# EAGLE design divtiesus_v10_tiesus_del_to (EAGLE 9.6.2)
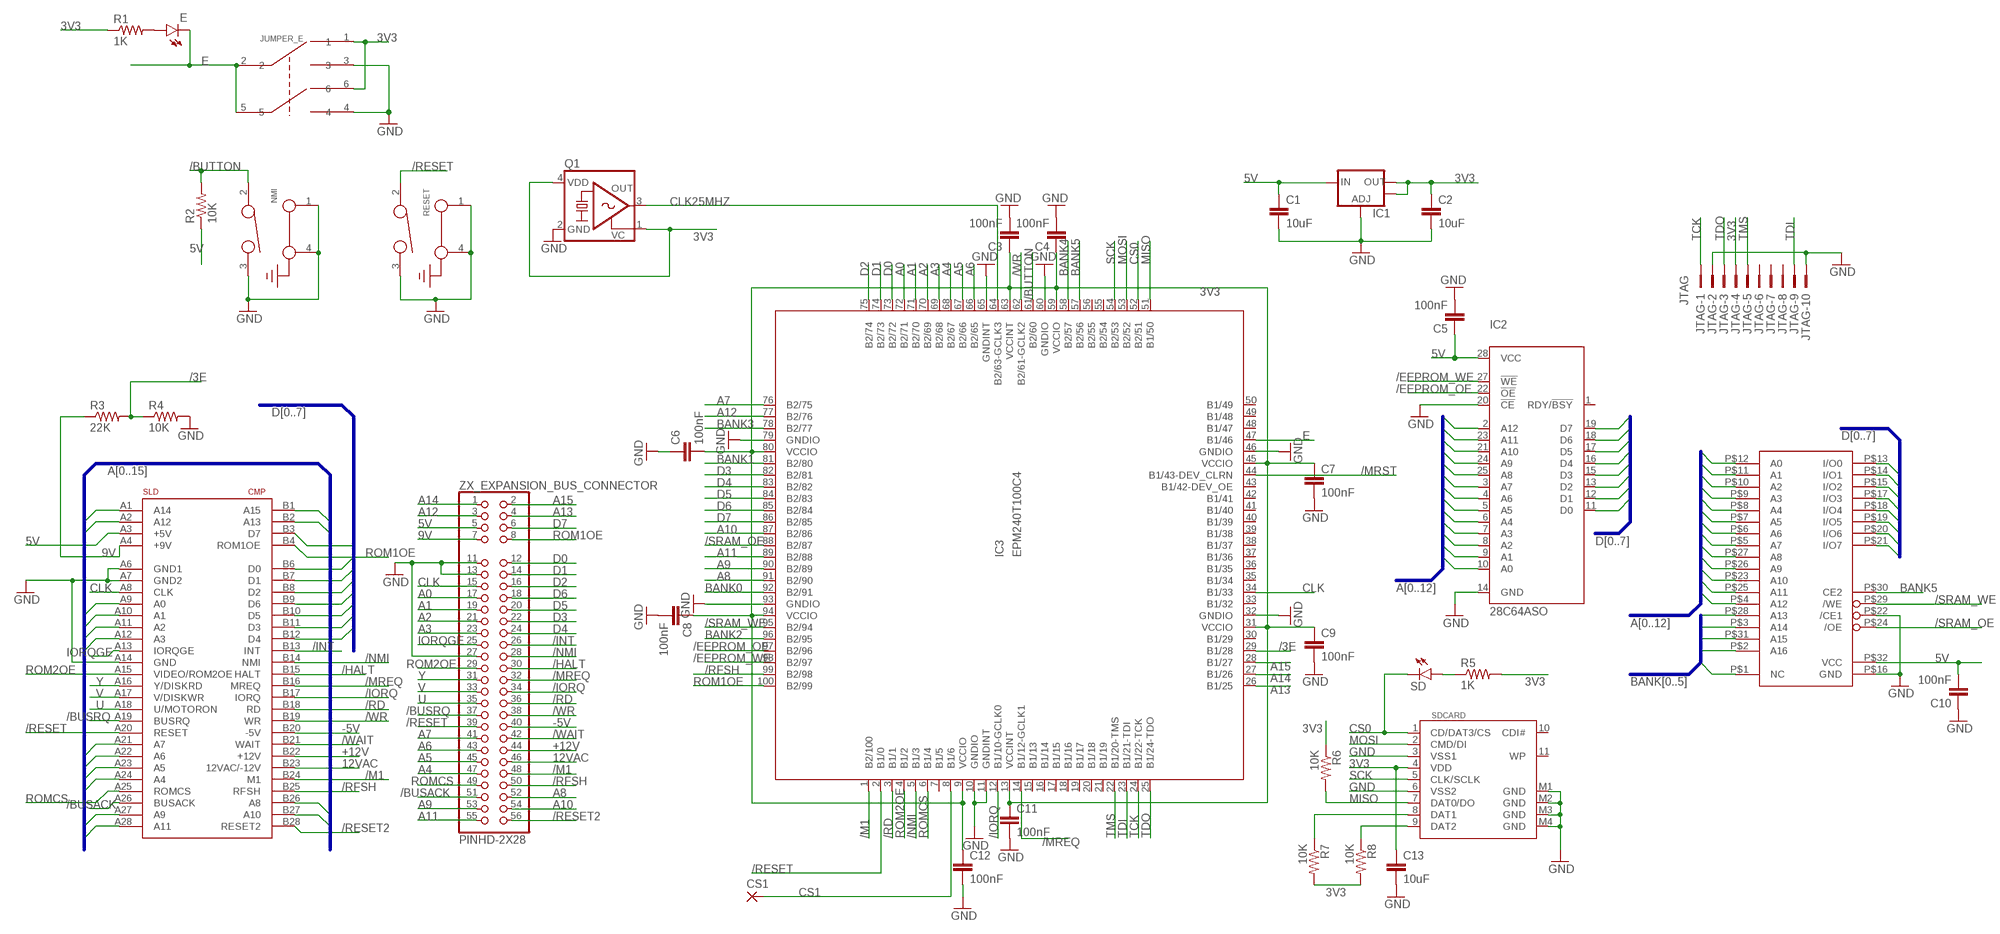
[diagram p0: schematic, sheet 1]

## Parts
C1  10uF  C-EUC0805  [C0805]
C2  10uF  C-EUC0805  [C0805]
C3  100nF  C-EUC0603K  [C0603K]
C4  100nF  C-EUC0603K  [C0603K]
C5  100nF  C-EUC0603K  [C0603K]
C6  100nF  C-EUC0603K  [C0603K]
C7  100nF  C-EUC0603K  [C0603K]
C8  100nF  C-EUC0603K  [C0603K]
C9  100nF  C-EUC0603K  [C0603K]
C10  100nF  C-EUC0603K  [C0603K]
C11  100nF  C-EUC0603K  [C0603K]
C12  100nF  C-EUC0603K  [C0603K]
C13  10uF  C-EUC0805  [C0805]
CS1  SMD2  [SMD1,27-2,54]
E  LEDCHIPLED_0805  [CHIPLED_0805]
IC1  V_REG_LM1117SOT223  [SOT223]
IC2  28C64ASO  [SO28W]
IC3  EPM240T100C4  [TQFP100]
IC4  IS65C1024ALSO32  [SO32-545MIL]
JTAG  JTAG  2510-  [PAK100/2500-10]
JUMPER_E  SWITCH_SMD_6PIN  [SMD-6PIN]
NMI  431256083716  [431256083716]
Q1  KXO-VCTCXO-SINE-84  [3.2X2.5_KXO-84-VCTCXO]
R1  1K  R-US_R0603  [R0603]
R2  10K  R-US_R0603  [R0603]
R3  22K  R-US_R0603  [R0603]
R4  10K  R-US_R0603  [R0603]
R5  1K  R-US_R0603  [R0603]
R6  10K  R-US_R0603  [R0603]
R7  10K  R-US_R0603  [R0603]
R8  10K  R-US_R0603  [R0603]
RESET  431256083716  [431256083716]
SD  LEDCHIPLED_0805  [CHIPLED_0805]
SDCARD  SDCARD  [SDCMF-10915W010]
U$1  CONECTOR_BUS_TRASERO  [CONECTOR_SIMPLE_CARA]
ZX_EXPANSION_BUS_CONNECTOR  PINHD-2X28  [2X28]

## Nets
3V3 [power]: C2.1 C3.1 C4.1 C6.2 C7.1 C8.1 C9.1 C11.1 C12.1 C13.1 IC1.2(OUT) IC1.4(OUT) IC3.9(VCCIO) IC3.13(VCCINT) IC3.31(VCCIO) IC3.45(VCCIO) IC3.59(VCCIO) IC3.63(VCCINT) IC3.80(VCCIO) IC3.94(VCCIO) JTAG.4 JUMPER_E.1 JUMPER_E.6 Q1.1(VC) Q1.4(VDD) R1.1 R5.2 R6.1 R7.2 R8.2 SDCARD.4(VDD)
5V [power]: C1.1 C5.1 C10.2 IC1.3(IN) IC2.28(VCC) IC4.P$32(VCC) R2.1 U$1.A3(+5V) ZX_EXPANSION_BUS_CONNECTOR.5
9V: R3.1 U$1.A4(+9V) ZX_EXPANSION_BUS_CONNECTOR.7
12VAC: U$1.B23(12VAC/-12V) ZX_EXPANSION_BUS_CONNECTOR.46
+12V: U$1.B22(+12V) ZX_EXPANSION_BUS_CONNECTOR.44
-5V: U$1.B20(-5V) ZX_EXPANSION_BUS_CONNECTOR.40
/3E: IC3.29(B1/28) R3.2 R4.1
/BUSACK: U$1.A26(BUSACK) ZX_EXPANSION_BUS_CONNECTOR.51
/BUSRQ: U$1.A19(BUSRQ) ZX_EXPANSION_BUS_CONNECTOR.37
/BUTTON: IC3.61(B2/60) NMI.2 R2.2
/EEPROM_OE: IC2.22(!OE) IC3.97(B2/96)
/EEPROM_WE: IC2.27(!WE) IC3.98(B2/97)
/HALT: U$1.B15(HALT) ZX_EXPANSION_BUS_CONNECTOR.30
/INT: U$1.B13(INT) ZX_EXPANSION_BUS_CONNECTOR.26
/IORQ: IC3.12(B1/10-GCLK0) U$1.B17(IORQ) ZX_EXPANSION_BUS_CONNECTOR.34
/M1: IC3.1(B2/100) U$1.B24(M1) ZX_EXPANSION_BUS_CONNECTOR.48
/MREQ: IC3.14(B1/12-GCLK1) U$1.B16(MREQ) ZX_EXPANSION_BUS_CONNECTOR.32
/MRST: IC3.44(B1/43-DEV_CLRN)
/NMI: IC3.5(B1/3) U$1.B14(NMI) ZX_EXPANSION_BUS_CONNECTOR.28
/RD: IC3.3(B1/1) U$1.B18(RD) ZX_EXPANSION_BUS_CONNECTOR.36
/RESET: IC3.2(B1/0) RESET.2 U$1.A20(RESET) ZX_EXPANSION_BUS_CONNECTOR.39
/RESET2: U$1.B28(RESET2) ZX_EXPANSION_BUS_CONNECTOR.56
/RFSH: IC3.99(B2/98) U$1.B25(RFSH) ZX_EXPANSION_BUS_CONNECTOR.50
/SRAM_OE: IC3.88(B2/87) IC4.P$24(/OE)
/SRAM_WE: IC3.95(B2/94) IC4.P$29(/WE)
/WAIT: U$1.B21(WAIT) ZX_EXPANSION_BUS_CONNECTOR.42
/WR: IC3.62(B2/61-GCLK2) U$1.B19(WR) ZX_EXPANSION_BUS_CONNECTOR.38
A0: IC2.10(A0) IC3.72(B2/71) IC4.P$12(A0) U$1.A9(A0) ZX_EXPANSION_BUS_CONNECTOR.17
A1: IC2.9(A1) IC3.71(B2/70) IC4.P$11(A1) U$1.A10(A1) ZX_EXPANSION_BUS_CONNECTOR.19
A2: IC2.8(A2) IC3.70(B2/69) IC4.P$10(A2) U$1.A11(A2) ZX_EXPANSION_BUS_CONNECTOR.21
A3: IC2.7(A3) IC3.69(B2/68) IC4.P$9(A3) U$1.A12(A3) ZX_EXPANSION_BUS_CONNECTOR.23
A4: IC2.6(A4) IC3.68(B2/67) IC4.P$8(A4) U$1.A24(A4) ZX_EXPANSION_BUS_CONNECTOR.47
A5: IC2.5(A5) IC3.67(B2/66) IC4.P$7(A5) U$1.A23(A5) ZX_EXPANSION_BUS_CONNECTOR.45
A6: IC2.4(A6) IC3.66(B2/65) IC4.P$6(A6) U$1.A22(A6) ZX_EXPANSION_BUS_CONNECTOR.43
A7: IC2.3(A7) IC3.76(B2/75) IC4.P$5(A7) U$1.A21(A7) ZX_EXPANSION_BUS_CONNECTOR.41
A8: IC2.25(A8) IC3.91(B2/90) IC4.P$27(A8) U$1.B26(A8) ZX_EXPANSION_BUS_CONNECTOR.52
A9: IC2.24(A9) IC3.90(B2/89) IC4.P$26(A9) U$1.A27(A9) ZX_EXPANSION_BUS_CONNECTOR.53
A10: IC2.21(A10) IC3.87(B2/86) IC4.P$23(A10) U$1.B27(A10) ZX_EXPANSION_BUS_CONNECTOR.54
A11: IC2.23(A11) IC3.89(B2/88) IC4.P$25(A11) U$1.A28(A11) ZX_EXPANSION_BUS_CONNECTOR.55
A12: IC2.2(A12) IC3.77(B2/76) IC4.P$4(A12) U$1.A2(A12) ZX_EXPANSION_BUS_CONNECTOR.3
A13: IC3.26(B1/25) U$1.B2(A13) ZX_EXPANSION_BUS_CONNECTOR.4
A14: IC3.27(B1/26) U$1.A1(A14) ZX_EXPANSION_BUS_CONNECTOR.1
A15: IC3.28(B1/27) U$1.B1(A15) ZX_EXPANSION_BUS_CONNECTOR.2
BANK0: IC3.92(B2/91) IC4.P$28(A13)
BANK1: IC3.81(B2/80) IC4.P$3(A14)
BANK2: IC3.96(B2/95) IC4.P$31(A15)
BANK3: IC3.78(B2/77) IC4.P$2(A16)
BANK4: IC3.58(B2/57) IC4.P$1(NC)
BANK5: IC3.57(B2/56) IC4.P$30(CE2)
CLK: IC3.34(B1/33) U$1.A8(CLK) ZX_EXPANSION_BUS_CONNECTOR.15
CLK25MHZ: IC3.64(B2/63-GCLK3) Q1.3(OUT)
CS0: IC3.52(B2/51) SD.C SDCARD.1(CD/DAT3/CS)
CS1: CS1.1(P) IC3.8(B1/6)
D0: IC2.11(D0) IC3.73(B2/72) IC4.P$13(I/O0) U$1.B6(D0) ZX_EXPANSION_BUS_CONNECTOR.12
D1: IC2.12(D1) IC3.74(B2/73) IC4.P$14(I/O1) U$1.B7(D1) ZX_EXPANSION_BUS_CONNECTOR.14
D2: IC2.13(D2) IC3.75(B2/74) IC4.P$15(I/O2) U$1.B8(D2) ZX_EXPANSION_BUS_CONNECTOR.16
D3: IC2.15(D3) IC3.82(B2/81) IC4.P$17(I/O3) U$1.B11(D3) ZX_EXPANSION_BUS_CONNECTOR.22
D4: IC2.16(D4) IC3.83(B2/82) IC4.P$18(I/O4) U$1.B12(D4) ZX_EXPANSION_BUS_CONNECTOR.24
D5: IC2.17(D5) IC3.84(B2/83) IC4.P$19(I/O5) U$1.B10(D5) ZX_EXPANSION_BUS_CONNECTOR.20
D6: IC2.18(D6) IC3.85(B2/84) IC4.P$20(I/O6) U$1.B9(D6) ZX_EXPANSION_BUS_CONNECTOR.18
D7: IC2.19(D7) IC3.86(B2/85) IC4.P$21(I/O7) U$1.B3(D7) ZX_EXPANSION_BUS_CONNECTOR.6
E: E.C IC3.47(B1/46) JUMPER_E.2 JUMPER_E.5
GND [power]: C1.2 C2.2 C3.2 C4.2 C5.2 C6.1 C7.2 C8.2 C9.2 C10.1 C11.2 C12.2 C13.2 IC1.1(ADJ) IC2.14(GND) IC2.20(!CE) IC3.10(GNDIO) IC3.11(GNDINT) IC3.32(GNDIO) IC3.46(GNDIO) IC3.60(GNDIO) IC3.65(GNDINT) IC3.79(GNDIO) IC3.93(GNDIO) IC4.P$16(GND) IC4.P$22(/CE1) JTAG.2 JTAG.10 JUMPER_E.3 JUMPER_E.4 NMI.1(GND1) NMI.3 NMI.4(GND) Q1.2(GND) R4.2 RESET.1(GND1) RESET.3 RESET.4(GND) SDCARD.3(VSS1) SDCARD.6(VSS2) SDCARD.M1(GND) SDCARD.M2(GND) SDCARD.M3(GND) SDCARD.M4(GND) U$1.A6(GND1) U$1.A7(GND2) U$1.A14(GND) ZX_EXPANSION_BUS_CONNECTOR.11 ZX_EXPANSION_BUS_CONNECTOR.13 ZX_EXPANSION_BUS_CONNECTOR.27
IORQGE: U$1.A13(IORQGE) ZX_EXPANSION_BUS_CONNECTOR.25
MISO: IC3.51(B1/50) R6.2 SDCARD.7(DAT0/DO)
MOSI: IC3.53(B2/52) SDCARD.2(CMD/DI)
N$1: R5.1 SD.A
N$2: E.A R1.2
N$18: R7.1 SDCARD.8(DAT1)
N$20: R8.1 SDCARD.9(DAT2)
ROM1OE: IC3.100(B2/99) U$1.B4(ROM1OE) ZX_EXPANSION_BUS_CONNECTOR.8
ROM2OE: IC3.4(B1/2) U$1.A15(VIDEO/ROM2OE) ZX_EXPANSION_BUS_CONNECTOR.29
ROMCS: IC3.6(B1/4) U$1.A25(ROMCS) ZX_EXPANSION_BUS_CONNECTOR.49
SCK: IC3.54(B2/53) SDCARD.5(CLK/SCLK)
TCK: IC3.24(B1/22-TCK) JTAG.1
TDI: IC3.23(B1/21-TDI) JTAG.9
TDO: IC3.25(B1/24-TDO) JTAG.3
TMS: IC3.22(B1/20-TMS) JTAG.5
U: U$1.A18(U/MOTORON) ZX_EXPANSION_BUS_CONNECTOR.35
V: U$1.A17(V/DISKWR) ZX_EXPANSION_BUS_CONNECTOR.33
Y: U$1.A16(Y/DISKRD) ZX_EXPANSION_BUS_CONNECTOR.31
Unconnected: IC2.1(RDY/!BSY) IC3.7(B1/5) IC3.15(B1/13) IC3.16(B1/14) IC3.17(B1/15) IC3.18(B1/16) IC3.19(B1/17) IC3.20(B1/18) IC3.21(B1/19) IC3.30(B1/29) IC3.33(B1/32) IC3.35(B1/34) IC3.36(B1/35) IC3.37(B1/36) IC3.38(B1/37) IC3.39(B1/38) IC3.40(B1/39) IC3.41(B1/40) IC3.42(B1/41) IC3.43(B1/42-DEV_OE) IC3.48(B1/47) IC3.49(B1/48) IC3.50(B1/49) IC3.55(B2/54) IC3.56(B2/55) JTAG.6 JTAG.7 JTAG.8 SDCARD.10(CDI#) SDCARD.11(WP)

## Buses
A[0..15]
D[0..7]
A[0..12]
BANK[0..5]

## Library data of the parts
C1-C13 = rcl:C-EU: CAPACITOR, European symbol
CS1 = wirepad:SMD2: SMD PAD
E SD = led:LED: LED OSRAM: - CHIPLED LG R971, LG N971, LY N971, LG Q971, LY Q971, LO R971, LY R971 LH N974, LH R974 LS Q976, LO Q976, LY Q976 LO Q996 - Hyper CHIPLED LW Q18S LB Q993, LB Q99A, LB R99A - SideLED LS A670, LO A670, LY A670, LG A670, LP A670 LB A673, LV A673, LT A673, LW A673 LH A674 LY A675 LS A676, LA A676, LO A676, LY A676, LW A676 LS A679, LY A679, LG A679 - Hyper Micro SIDELED® LS Y876, LA Y876, LO Y876, LY Y876 LT Y87S - SmartLED LW L88C, LW L88S LB L89C, LB L89S, LG L890 LS L89K, LO L89K, LY L89K LS L896, LA L896, LO L896, LY L896 - TOPLED LS T670, LO T670, LY T670, LG T670, LP T670 LSG T670, LSP T670, LSY T670, LOP T670, LYG T670 LG T671, LOG T671, LSG T671 LB T673, LV T673, LT T673, LW T673 LH T674 LS T676, LA T676, LO T676, LY T676, LB T676, LH T676, LSB T676, LW T676 LB T67C, LV T67C, LT T67C, LS T67K, LO T67K, LY T67K, LW E67C LS E67B, LA E67B, LO E67B, LY E67B, LB E67C, LV E67C, LT E67C LW T67C LS T679, LY T679, LG T679 LS T770, LO T770, LY T770, LG T770, LP T770 LB T773, LV T773, LT T773, LW T773 LH T774 LS E675, LA E675, LY E675, LS T675 LS T776, LA T776, LO T776, LY T776, LB T776 LHGB T686 LT T68C, LB T68C - Hyper Mini TOPLED® LB M676 - Mini TOPLED Santana® LG M470 LS M47K, LO M47K, LY M47K Source: http://www.osram.convergy.de LUXEON: - LUMILED® LXK2-PW12-R00, LXK2-PW12-S00, LXK2-PW14-U00, LXK2-PW14-V00 LXK2-PM12-R00, LXK2-PM12-S00, LXK2-PM14-U00 LXK2-PE12-Q00, LXK2-PE12-R00, LXK2-PE12-S00, LXK2-PE14-T00, LXK2-PE14-U00 LXK2-PB12-K00, LXK2-PB12-L00, LXK2-PB12-M00, LXK2-PB14-N00, LXK2-PB14-P00, LXK2-PB14-Q00 LXK2-PR12-L00, LXK2-PR12-M00, LXK2-PR14-Q00, LXK2-PR14-R00 LXK2-PD12-Q00, LXK2-PD12-R00, LXK2-PD12-S00 LXK2-PH12-R00, LXK2-PH12-S00 LXK2-PL12-P00, LXK2-PL12-Q00, LXK2-PL12-R00 Source: www.luxeon.com KINGBRIGHT: KA-3528ASYC Source: www.kingbright.com
IC1 = SparkFun:V_REG_LM1117: Voltage Regulator LM1117 Standard adjustable voltage regulator but in SMD form. Spark Fun Electronics SKU : COM-00595
IC2 = microchip:28*64A: CMOS EEPROM 64 K (8 K x 8), low voltage; MPN: CAT28C64BWI-12; OC_FARNELL: 1718312; OC_NEWARK: 06R0739
IC3 = altera:EPM240T100C4: EPM240T100 Low-cost, low-power CPLD Auto generated by make-symbol-device-package-bsdl.ulp Rev. 35 Source: www.altera.com .. epm240-io.txt; MPN: EPM240T100C4; OC_FARNELL: 1453502; OC_NEWARK: 51R9357
IC4 = SRAM512KB-DIL32-SMD:IS65C1024AL
JTAG = con-3m:2510-: 3M (TM) Pak 100 4-Wall Header Source: 3M; MF: 3M; MPN: 2510-6002UB; OC_FARNELL: 9838244; OC_NEWARK: 46F4725
JUMPER_E = switch-misc:SWITCH_SMD_6PIN
NMI RESET = Eagle_SWITCHES (rev18c):431256083716: 6x6 mm THT right angled with ground terminal WS-TATU <http://katalog.we-online.de/media/images/v2/Family_WS_TST_THT_4312560xx7x6_pf2.jpg> Details see: http://katalog.we-online.de/em/datasheet/4312x6xxx7x6.pdf <http://katalog.we-online.de/em/datasheet/4312x6xxx7x6.pdfL> 2015 (C) Wurth Elektronik
Q1 = crystal-geyer_V1_0:KXO-VCTCXO-SINE: VCTCXO : Sinewave - Serie Model Size l/w/h [mm] Frequency Range Frequency Stability Temp. Range [°C] Output AECQ 200 availabel Datasheet KXO-81 KXO-86 KXO-84 KXO-83 KXO-82 2.0/1.6/0.7 2.5/2.0/0.7 3.2/2.5/1.0 5.0/3.2/1.5 7.0/5.0/2.0 13,0 ~ 40,0 MHz 13,0 ~ 40,0 MHz 8,0 ~ 40,0 MHz 12,0 ~ 26,0 MHz 12,6 ~ 20,0 MHz ±1,0 … ±2,5ppm ±1,0 … ±2,5ppm ±1,0 … ±2,5ppm ±1,0 … ±2,5ppm ±1,0 … ±2,5ppm (*) -40°C …+85°C (*) -30°C …+75°C (*) -40°C …+85°C (*) -40°C …+85°C (*) -30°C …+80°C Sinewave Sinewave Sinewave Sinewave Sinewave - - - - - KXO-81.pdf <http://www.geyer-electronic.de/uploads/tx_userartikelfrequenz/GEYER-KXO-81-VCTCXO-sinewave.pdf> KXO-86.pdf <http://www.geyer-electronic.de/uploads/tx_userartikelfrequenz/GEYER-KXO-86-VCTCXO-sinewave.pdf> KXO-84.pdf <http://www.geyer-electronic.de/uploads/tx_userartikelfrequenz/GEYER-KXO-84-VCTCXO-sinewave.pdf> KXO-83.pdf <http://www.geyer-electronic.de/uploads/tx_userartikelfrequenz/GEYER-KXO-83-VCTCXO-sinewave.pdf> KXO-82.pdf <http://www.geyer-electronic.de/uploads/tx_userartikelfrequenz/GEYER-KXO-82-VCTCXO-sinewave.pdf> <http://www.geyer-electronic.de/fileadmin/template/img/logo-geyer-electronic.png> Details see: http://www.geyer-electronic.de/Frequenz-Produkte.9.0.html Created 2016-06-07, Hans Locher 2016 (C) Geyer Quartz Technology KXO81,KXO86,KXO84,KXO83,KXO82,2016;2520;3225;5032;7050;2,0x1,6;2,5x2,0;3,2x2,5;5,0x3,2;7,0x5,0;2.0x1.6;2.5x2.0;3.2x2.5;5.0x3.2;7.0x5.0;
R1-R8 = rcl:R-US_: RESISTOR, American symbol
SDCARD = zxuno_v41:SDCARD: SD card connector KINGFONT SDCMF-10915W010
U$1 = zx_spectrum:CONECTOR_BUS_TRASERO
ZX_EXPANSION_BUS_CONNECTOR = zx_spectrum:PINHD-2X28

## Net classes
0 default: width 0.14 mm, drill 0.305 mm, clearance 0.14 mm
1 power: width 0.203 mm, drill 0.305 mm, clearance 0.14 mm

## Board
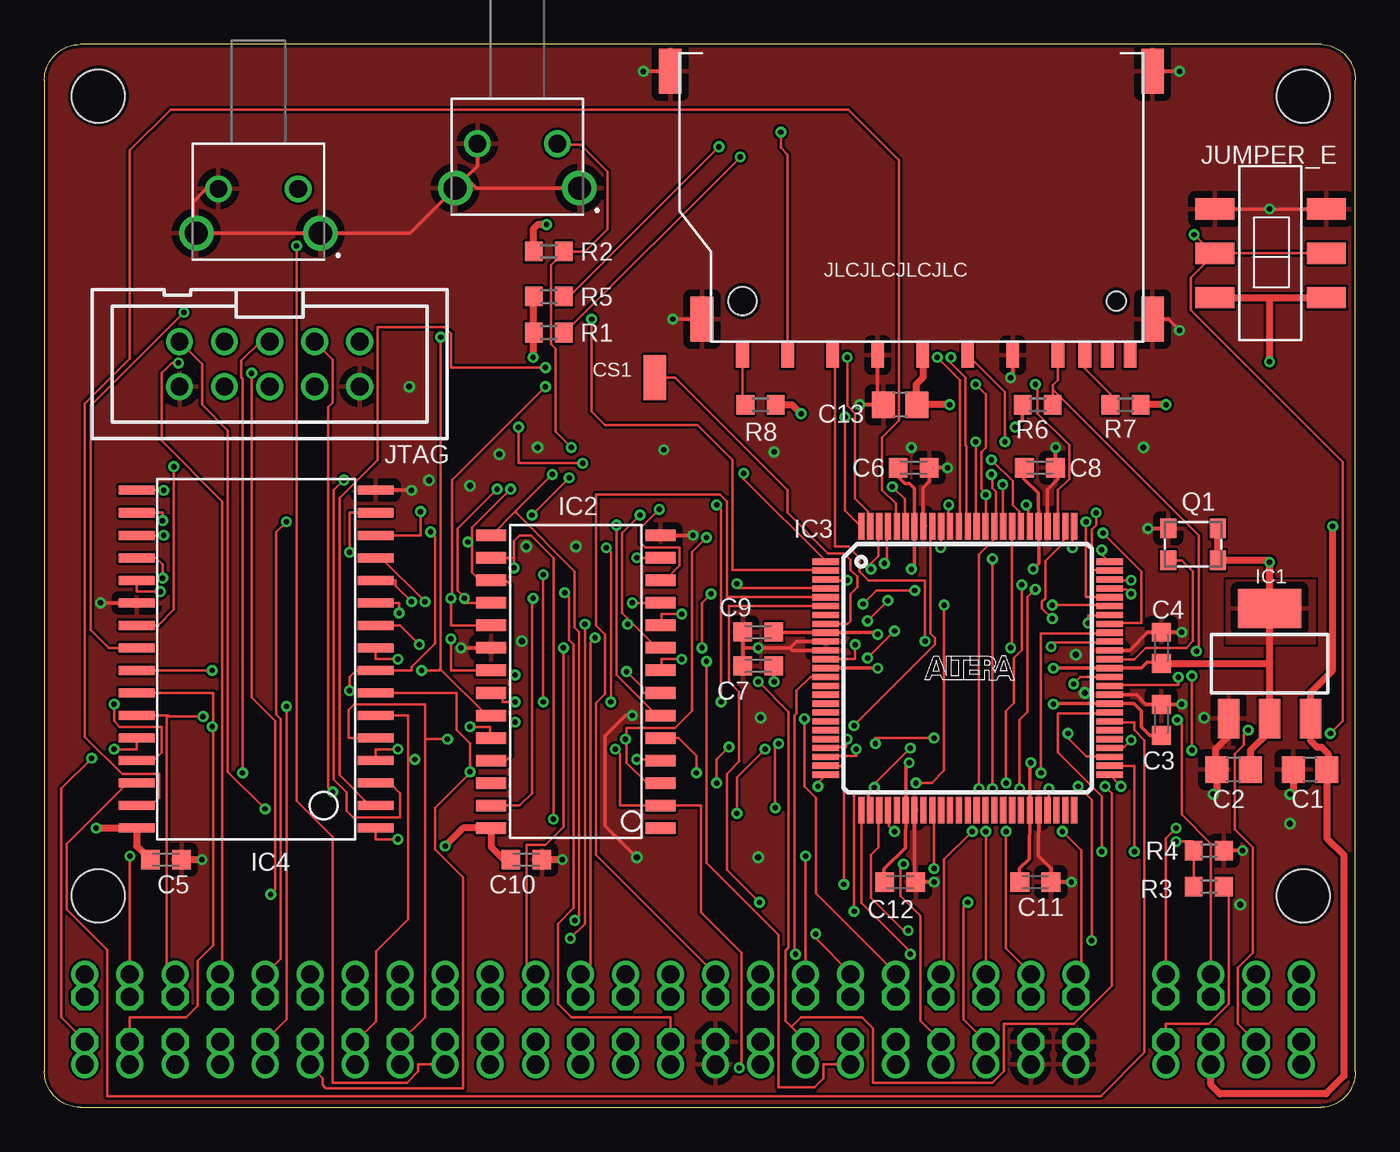
[diagram p1: board, top side]
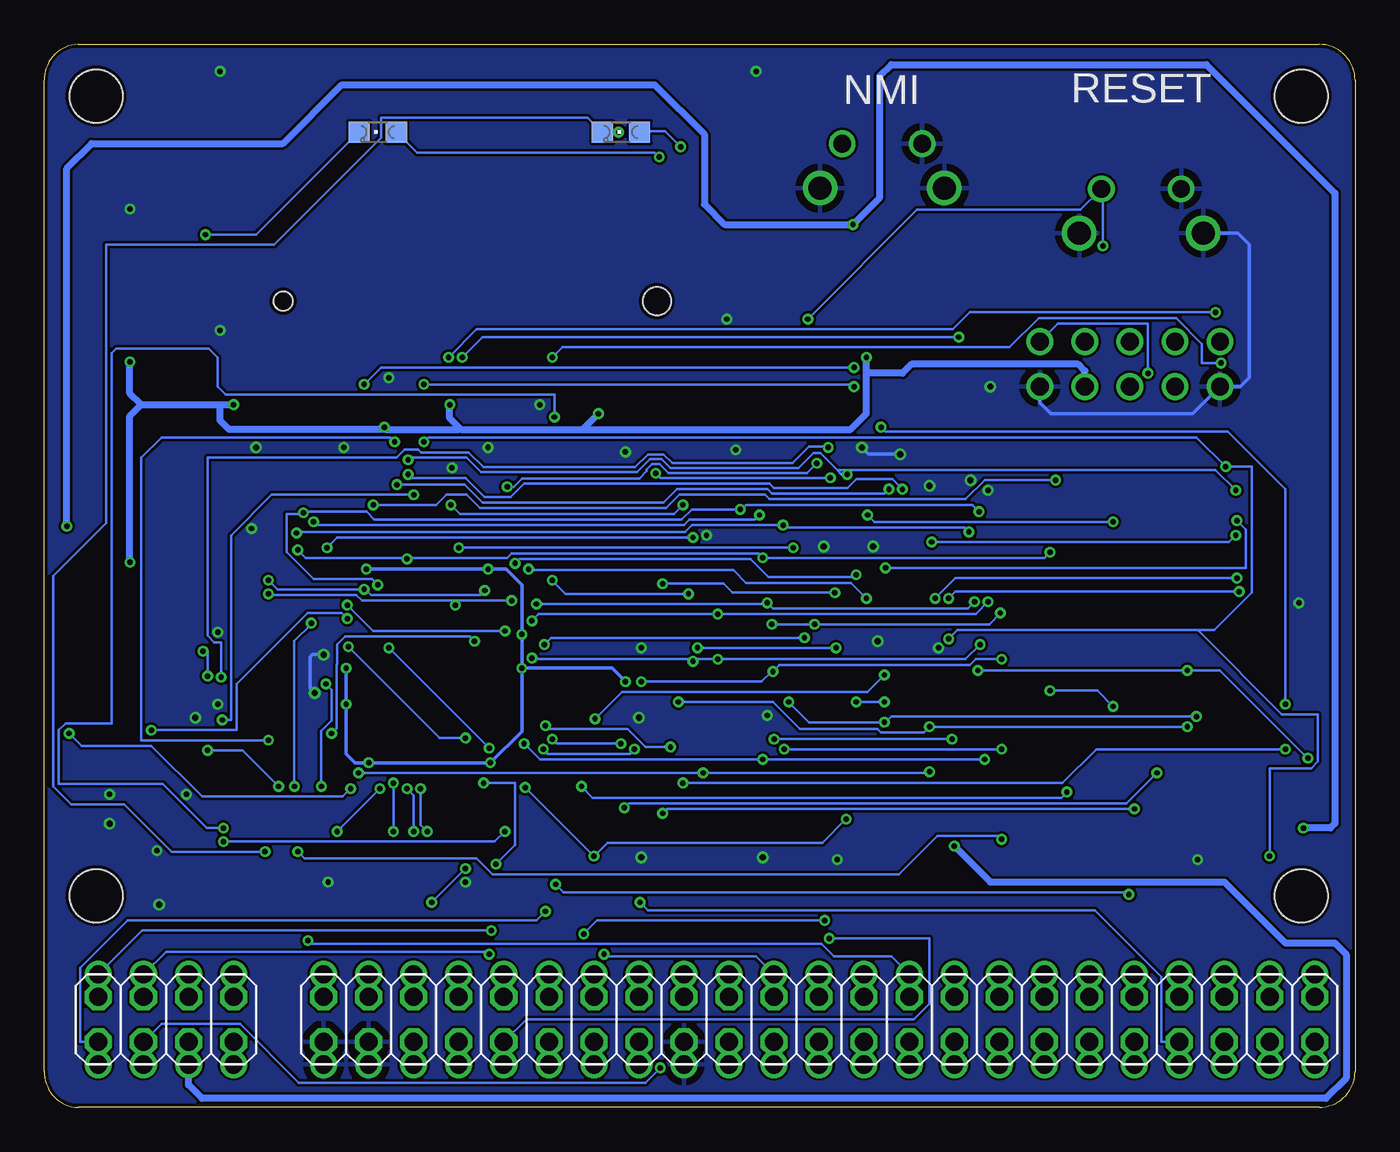
[diagram p2: board, bottom side, seen from below]

Size 73.91 x 59.94 mm. Coordinates in mm from the lower left corner, seen from the top.
Outline: 2.03,0 72.01,0 arc90 73.91,2.03 73.91,57.91 arc90 72.01,59.94 2.03,59.94 arc90 0,57.91 0,2.03 arc90 2.03,0
Copper layers (1*16): Top 0.035mm / dielectric 1.5mm / Bottom 0.035mm
Design rules "jlcpcb_2_layer *": minimum track width 5mil, minimum drill 12mil, track to track 5mil, track to pad 5mil, pad to pad 5mil, via to via 5mil, smd to smd 0mil, copper to edge 8mil, drill to drill 8mil, minimum pad ring 10mil, minimum via ring 6mil, stop-mask expansion 2mil, vias tented up to drill 25mil, thermal gap 16mil
Holes 3 mm at 3.05,57.02 70.99,57.02 3.05,11.94 70.99,11.94

### Footprints (pad centres in the part's own frame; a part is rotated, then mirrored left to right if it is on the bottom)
C0805 = smd 1.3 x 1.5: 1 -0.95,0; 2 0.95,0
C0603K = smd 1.05 x 1.08: 1 -0.875,0; 2 0.875,0
SMD1,27-2,54 = smd 1.27 x 2.54: 1 0,0
CHIPLED_0805 = smd 1.2 x 1.2: A 0,-1.05; C 0,1.05
SOT223 = smd 1.219 x 2.235: 1 -2.311,-3.099; 2 0,-3.099; 3 2.311,-3.099 | smd 3.6 x 2.2: 4 0,3.099
SO28W = smd 0.65 x 1.7: 1 -7.62,-4.78; 2 -6.35,-4.78; 3 -5.08,-4.78; 4 -3.81,-4.78; 5 -2.54,-4.78; 6 -1.27,-4.78; 7 0,-4.78; 8 1.27,-4.78; 9 2.54,-4.78; 10 3.81,-4.78; 11 5.08,-4.78; 12 6.35,-4.78; 13 7.62,-4.78; 14 8.89,-4.78; 15 8.89,4.78; 16 7.62,4.78; 17 6.35,4.78; 18 5.08,4.78; 19 3.81,4.78; 20 2.54,4.78; 21 1.27,4.78; 22 0,4.78; 23 -1.27,4.78; 24 -2.54,4.78; 25 -3.81,4.78; 26 -5.08,4.78; 27 -6.35,4.78; 28 -7.62,4.78
TQFP100 = smd 1.5 x 0.35: 1 -8,6; 2 -8,5.5; 3 -8,5; 4 -8,4.5; 5 -8,4; 6 -8,3.5; 7 -8,3; 8 -8,2.5; 9 -8,2; 10 -8,1.5; 11 -8,1; 12 -8,0.5; 13 -8,0; 14 -8,-0.5; 15 -8,-1; 16 -8,-1.5; 17 -8,-2; 18 -8,-2.5; 19 -8,-3; 20 -8,-3.5; 21 -8,-4; 22 -8,-4.5; 23 -8,-5; 24 -8,-5.5; 25 -8,-6; 51 8,-6; 52 8,-5.5; 53 8,-5; 54 8,-4.5; 55 8,-4; 56 8,-3.5; 57 8,-3; 58 8,-2.5; 59 8,-2; 60 8,-1.5; 61 8,-1; 62 8,-0.5; 63 8,0; 64 8,0.5; 65 8,1; 66 8,1.5; 67 8,2; 68 8,2.5; 69 8,3; 70 8,3.5; 71 8,4; 72 8,4.5; 73 8,5; 74 8,5.5; 75 8,6 | smd 0.35 x 1.5: 26 -6,-8; 27 -5.5,-8; 28 -5,-8; 29 -4.5,-8; 30 -4,-8; 31 -3.5,-8; 32 -3,-8; 33 -2.5,-8; 34 -2,-8; 35 -1.5,-8; 36 -1,-8; 37 -0.5,-8; 38 0,-8; 39 0.5,-8; 40 1,-8; 41 1.5,-8; 42 2,-8; 43 2.5,-8; 44 3,-8; 45 3.5,-8; 46 4,-8; 47 4.5,-8; 48 5,-8; 49 5.5,-8; 50 6,-8; 76 6,8; 77 5.5,8; 78 5,8; 79 4.5,8; 80 4,8; 81 3.5,8; 82 3,8; 83 2.5,8; 84 2,8; 85 1.5,8; 86 1,8; 87 0.5,8; 88 0,8; 89 -0.5,8; 90 -1,8; 91 -1.5,8; 92 -2,8; 93 -2.5,8; 94 -3,8; 95 -3.5,8; 96 -4,8; 97 -4.5,8; 98 -5,8; 99 -5.5,8; 100 -6,8
SO32-545MIL = smd 0.508 x 2.032: P$1 -8.89,-5.461; P$2 -7.62,-5.461; P$3 -6.35,-5.461; P$4 -5.08,-5.461; P$5 -3.81,-5.461; P$6 -2.54,-5.461; P$7 -1.27,-5.461; P$8 0,-5.461; P$9 1.27,-5.461; P$10 2.54,-5.461; P$11 3.81,-5.461; P$12 5.08,-5.461; P$13 6.35,-5.461; P$14 7.62,-5.461; P$15 8.89,-5.461; P$16 10.16,-5.461; P$17 10.16,8.001; P$18 8.89,8.001; P$19 7.62,8.001; P$20 6.35,8.001; P$21 5.08,8.001; P$22 3.81,8.001; P$23 2.54,8.001; P$24 1.27,8.001; P$25 0,8.001; P$26 -1.27,8.001; P$27 -2.54,8.001; P$28 -3.81,8.001; P$29 -5.08,8.001; P$30 -6.35,8.001; P$31 -7.62,8.001; P$32 -8.89,8.001
PAK100/2500-10 = drill 1 pad 1.422: 1 -5.08,-1.27; 2 -5.08,1.27; 3 -2.54,-1.27; 4 -2.54,1.27; 5 0,-1.27; 6 0,1.27; 7 2.54,-1.27; 8 2.54,1.27; 9 5.08,-1.27; 10 5.08,1.27
SMD-6PIN = smd 1.2 x 2.2: 1 -2.6,-3.2; 2 -0.1,-3.2; 3 2.4,-3.2; 4 2.4,3.1; 5 -0.1,3.1; 6 -2.6,3.1
431256083716 = drill 1.3: 1 -3.5,1.25; 4 3.5,1.25 | drill 1: 2 -2.25,-1.25; 3 2.25,-1.25
3.2X2.5_KXO-84-VCTCXO = smd 0.9 x 1.1: 1 -1.4,-0.9; 2 1.4,-0.9; 3 1.4,0.9; 4 -1.4,0.9
R0603 = smd 1 x 1.1: 1 -0.85,0; 2 0.85,0
SDCMF-10915W010 = smd 0.711 x 1.422: 1 7.366,13.462; 2 4.826,13.462; 3 2.286,13.462; 4 -0.254,13.462; 5 -2.794,13.462; 6 -5.334,13.462; 7 -7.874,13.462; 8 -9.398,13.462; 9 9.906,13.462; 10 -11.938,13.462; 11 -10.668,13.462 | smd 1.27 x 2.54: M1 12.192,11.43; M2 13.97,-2.54; M3 -13.208,-2.54; M4 -13.208,11.43 | hole 1.6: 9.906,10.414 | hole 1.1: -11.176,10.414
CONECTOR_SIMPLE_CARA = drill 1.016 pad 1.422: A1 -2.54,17.78; A2 -2.54,15.24; A3 -2.54,12.7; A4 -2.54,10.16; A6 -2.54,5.08; A7 -2.54,2.54; A8 -2.54,0; A9 -2.54,-2.54; A10 -2.54,-5.08; A11 -2.54,-7.62; A12 -2.54,-10.16; A13 -2.54,-12.7; A14 -2.54,-15.24; A15 -2.54,-17.78; A16 -2.54,-20.32; A17 -2.54,-22.86; A18 -2.54,-25.4; A19 -2.54,-27.94; A20 -2.54,-30.48; A21 -2.54,-33.02; A22 -2.54,-35.56; A23 -2.54,-38.1; A24 -2.54,-40.64; A25 -2.54,-43.18; A26 -2.54,-45.72; A27 -2.54,-48.26; A28 -2.54,-50.8; B1 2.54,17.78; B2 2.54,15.24; B3 2.54,12.7; B4 2.54,10.16; B6 2.54,5.08; B7 2.54,2.54; B8 2.54,0; B9 2.54,-2.54; B10 2.54,-5.08; B11 2.54,-7.62; B12 2.54,-10.16; B13 2.54,-12.7; B14 2.54,-15.24; B15 2.54,-17.78; B16 2.54,-20.32; B17 2.54,-22.86; B18 2.54,-25.4; B19 2.54,-27.94; B20 2.54,-30.48; B21 2.54,-33.02; B22 2.54,-35.56; B23 2.54,-38.1; B24 2.54,-40.64; B25 2.54,-43.18; B26 2.54,-45.72; B27 2.54,-48.26; B28 2.54,-50.8
2X28 = drill 1.016 octagon: 1 -33.02,-1.27; 2 -33.02,1.27; 3 -30.48,-1.27; 4 -30.48,1.27; 5 -27.94,-1.27; 6 -27.94,1.27; 7 -25.4,-1.27; 8 -25.4,1.27; 11 -20.32,-1.27; 12 -20.32,1.27; 13 -17.78,-1.27; 14 -17.78,1.27; 15 -15.24,-1.27; 16 -15.24,1.27; 17 -12.7,-1.27; 18 -12.7,1.27; 19 -10.16,-1.27; 20 -10.16,1.27; 21 -7.62,-1.27; 22 -7.62,1.27; 23 -5.08,-1.27; 24 -5.08,1.27; 25 -2.54,-1.27; 26 -2.54,1.27; 27 0,-1.27; 28 0,1.27; 29 2.54,-1.27; 30 2.54,1.27; 31 5.08,-1.27; 32 5.08,1.27; 33 7.62,-1.27; 34 7.62,1.27; 35 10.16,-1.27; 36 10.16,1.27; 37 12.7,-1.27; 38 12.7,1.27; 39 15.24,-1.27; 40 15.24,1.27; 41 17.78,-1.27; 42 17.78,1.27; 43 20.32,-1.27; 44 20.32,1.27; 45 22.86,-1.27; 46 22.86,1.27; 47 25.4,-1.27; 48 25.4,1.27; 49 27.94,-1.27; 50 27.94,1.27; 51 30.48,-1.27; 52 30.48,1.27; 53 33.02,-1.27; 54 33.02,1.27; 55 35.56,-1.27; 56 35.56,1.27

### Placement (x,y rotation side)
C1  71.37,19.05 180 top
C2  67.06,19.05 180 top
C3  62.99,21.84 90 top
C4  62.99,25.91 90 top
C5  6.86,13.97 0 top
C6  49.02,36.07 180 top
C7  40.26,26.8 180 top
C8  56.13,36.07 0 top
C9  40.26,24.89 180 top
C10  27.18,13.97 180 top
C11  55.88,12.7 0 top
C12  48.26,12.7 0 top
C13  48.26,39.62 180 top
CS1  34.42,41.15 0 top
E  55.12,54.99 90 bottom
IC1  69.09,25.02 0 top
IC2  29.97,23.37 90 top
IC3  52.07,24.77 0 top
IC4  13.21,24.64 90 top
JTAG  12.7,41.91 180 top
JUMPER_E  69.09,48.26 90 top
NMI  26.67,53.09 180 top
Q1  64.77,31.75 180 top
R1  28.45,43.69 0 top
R2  28.45,48.26 0 top
R3  65.66,12.45 180 top
R4  65.66,14.48 0 top
R5  28.45,45.72 180 top
R6  56.01,39.62 0 top
R7  60.96,39.62 0 top
R8  40.39,39.62 0 top
RESET  12.06,50.55 180 top
SD  41.4,54.99 90 bottom
SDCARD  49.28,55.88 180 top
U$1  53.09,4.95 90 bottom
ZX_EXPANSION_BUS_CONNECTOR  37.85,4.95 0 bottom

### Tracks (layer width: path | path; a pad name or v marks a point on that pad's centre or on a via)
3V3  (via drill 0.3)
  Top 0.203: C4.1 62.21,25.12 61.85,24.77 IC3.63 v56.9,24.77 | C3.1 62.34,20.98 61.85,21.46 61.85,22.35 61.43,22.77 IC3.59 56.93,22.77 v56.9,22.73 | C11.1 54.99,12.78 54.99,13.46 55.55,14.02 IC3.45 55.57,19.38 v55.63,19.43 | C7.1 41.13,26.77 IC3.9 46.9,26.77 v46.99,26.67 | C12.1 47.35,12.73 47.35,13.44 48.55,14.64 IC3.31 48.57,19.23 v48.77,19.43 | C6.2 48.15,35.55 48.51,35.18 48.77,35.18 49.05,34.9 IC3.94 49.07,30.53 v48.9,30.35 | C8.1 55.24,36.05 55.24,35.43 56.05,34.63 IC3.80 56.07,30.67 v55.75,30.35 | 49.15,39.69 C13.1 | IC1.2 69.09,21.21 | 69.07,25.03 69.09,25.02 | IC3.13 v46.99,24.77 | 68.97,30.85 v69.09,30.73 | R6.1 55.16,38.77 v54.74,38.35 | 27.56,43.65 R1.1 | C9.1 41.15,24.88 v41.15,24
  Top 0.406: Q1.1 Q1.4 68.97,30.85 | C2.1 68.01,20.13 69.09,21.21 | SDCARD.4 49.53,41.15 49.15,40.77 49.15,39.69 | JUMPER_E.6 69.09,45.66 | 69.09,45.66 JUMPER_E.1 | IC1.2 69.09,25.02 IC1.4 v69.09,30.73 | C4.1 69.07,25.03 | v51.05,39.62 C13.1 | R8.2 42.16,39.62 v42.67,39.12 | v63.25,39.62 R7.2 | 27.56,43.65 v27.56,42.29 | R1.1 R5.2 | v69.09,42.04 69.09,45.66
  Bottom 0.203: v56.9,24.77 v56.9,22.73 56.9,19.94 56.39,19.43 v55.63,19.43 v48.77,19.43 46.99,21.21 46.99,24.64 | 46.99,24.64 v46.99,24.77 v46.99,26.67 46.99,29.46 47.88,30.35 v48.9,30.35 v55.75,30.35 | 50.42,38.23 50.48,38.29 50.55,38.23 | v54.74,38.35 54.61,38.23 | v41.15,24 41.91,24.77 46.86,24.77 46.99,24.64
  Bottom 0.406: 68.45,39.62 69.09,40.26 v69.09,42.04 | v42.67,39.12 43.56,38.23 | 50.48,38.29 51.05,38.86 v51.05,39.62 | 50.42,38.23 43.56,38.23 | 50.55,38.23 54.61,38.23 63.5,38.23 64.01,38.73 64.01,39.62 | v69.09,30.73 69.09,38.99 68.45,39.62 | 68.45,39.62 64.01,39.62 | 64.01,39.62 v63.25,39.62 | 43.56,38.23 28.45,38.23 27.56,39.12 27.56,41.4 | 27.56,41.4 v27.56,42.29 | JTAG.4 15.24,41.53 15.62,41.91 25.02,41.91 25.53,41.4 27.56,41.4
  pour Top: 66.67,29.72 71.63,29.72 71.63,26.16 66.67,26.16
5V  (via drill 0.3)
  Top 0.203: 25.91,13.97 C10.2 | IC4.P$32 5.21,15.62 | C5.1 | 72.39,19.12 C1.1 | IC1.3 71.4,20.68 | U$1.A3 ZX_EXPANSION_BUS_CONNECTOR.5
  Top 0.406: 25.91,13.97 25.19,14.69 IC2.28 23.62,15.75 v22.61,14.73 | C5.1 5.21,14.73 5.21,15.62 5.08,15.75 v2.92,15.75 | 72.39,19.12 72.39,19.94 72.01,20.32 71.75,20.32 71.4,20.68 | C1.1 72.32,15.18 73.28,14.22 73.28,1.78 72.26,0.76 66.29,0.76 65.79,1.27 U$1.A3 | IC1.3 71.4,23.39 72.64,24.64 v72.64,32.77 | v28.32,49.78 27.81,49.78 27.56,49.53 27.56,48.3 R2.1
  Bottom 0.406: v72.64,32.77 72.64,52.96 71.25,54.35 60.45,54.35 57.15,57.66 39.5,57.66 36.7,54.86 36.7,50.93 35.56,49.78 v28.32,49.78 26.8,51.31 26.8,58.17 26.16,58.8 8.38,58.8 1.14,51.56 1.14,16 1.4,15.75 v2.92,15.75 | v22.61,14.73 20.57,12.7 7.37,12.7 3.94,9.27 1.14,9.27 0.51,8.64 0.51,1.65 1.65,0.51 65.02,0.51 65.79,1.27 U$1.A3
9V
  Top 0.14: R3.1 66.8,12.45 66.8,5.84 65.66,4.7 63.25,4.7 ZX_EXPANSION_BUS_CONNECTOR.7 U$1.A4
12VAC
  Top 0.14: U$1.B23 ZX_EXPANSION_BUS_CONNECTOR.46
+12V
  Top 0.14: U$1.B22 ZX_EXPANSION_BUS_CONNECTOR.44
-5V
  Top 0.14: U$1.B20 ZX_EXPANSION_BUS_CONNECTOR.40
/3E  (via drill 0.3)
  Top 0.14: v47.94,15.56 47.62,15.88 47.62,16.76 IC3.29 | v63.82,14.99 64.77,14.99 64.77,14.54 R4.1
  Top 0.152: R4.1 R3.2
  Bottom 0.14: v47.94,15.56 48.51,14.99 v63.82,14.99
/BUSACK
  Top 0.14: ZX_EXPANSION_BUS_CONNECTOR.51 U$1.A26
/BUSRQ
  Top 0.14: ZX_EXPANSION_BUS_CONNECTOR.37 U$1.A19
/BUTTON  (via drill 0.3)
  Top 0.14: NMI.2 28.96,54.29 30.23,54.29 31.75,52.77 31.75,49.53 30.48,48.26 R2.2 29.27,48.2 28.57,47.5 28.57,43.05 28.83,42.8 28.83,38.1 v29.72,37.21 | v63.94,24.26 63.94,23.81 60.07,23.81 IC3.61
  Bottom 0.14: v63.94,24.26 63.94,26.23 64.33,26.23 64.71,26.61 64.71,36.64 54.04,36.64 53.59,37.08 52.83,37.08 52.67,36.92 49.99,36.92 49.16,36.09 40.61,36.09 39.88,36.82 38.99,36.82 38.5,36.34 31.74,36.34 30.8,37.27 29.78,37.27 v29.72,37.21
/EEPROM_OE  (via drill 0.3)
  Top 0.14: v47.37,30.67 47.5,30.8 47.5,32.64 47.56,32.7 IC3.97 | v28.13,22.86 v28.13,30.04 | v26.54,22.86 25.84,22.86 25.84,23.37 IC2.22
  Bottom 0.14: v47.37,30.67 47.12,30.92 34.1,30.92 33.08,29.91 28.26,29.91 v28.13,30.04 | v26.54,22.86 v28.13,22.86
/EEPROM_WE  (via drill 0.3)
  Top 0.14: v46.61,30.35 46.61,30.67 47.04,31.1 47.04,32.69 47.05,32.7 IC3.98 | v27.56,28.7 27.5,28.64 27.5,17.72 26.8,17.02 IC2.27
  Bottom 0.14: v46.61,30.35 46.55,30.29 35.05,30.29 34.34,29.58 28.43,29.58 v27.56,28.7
/HALT
  Top 0.14: U$1.B15 ZX_EXPANSION_BUS_CONNECTOR.30
/INT
  Top 0.14: U$1.B13 ZX_EXPANSION_BUS_CONNECTOR.26
/IORQ  (via drill 0.3)
  Top 0.14: v45.72,26.1 45.72,25.27 44.13,25.27 IC3.12 | v31.05,26.48 30.8,26.23 30.8,8.06 U$1.B17 ZX_EXPANSION_BUS_CONNECTOR.34
  Bottom 0.14: v45.72,26.1 45.34,26.48 v31.05,26.48
/M1  (via drill 0.3)
  Top 0.14: v39.43,35.75 39.43,35.43 44.07,30.8 IC3.1 | v27.5,33.4 v29.59,35.5 | v13.65,33.02 13.08,32.45 13.08,22.16 13.34,21.91 13.34,8.38 U$1.B24 ZX_EXPANSION_BUS_CONNECTOR.48
  Bottom 0.14: v39.43,35.75 39.18,35.5 v29.59,35.5 | v27.5,33.4 27.11,33.02 v13.65,33.02
/MREQ  (via drill 0.3)
  Top 0.14: v42.35,8.64 42.29,8.7 42.29,22.1 42.42,22.23 42.42,23.5 43.19,24.27 IC3.14
  Bottom 0.14: v42.35,8.64 42.23,8.51 33.78,8.51 U$1.B16 ZX_EXPANSION_BUS_CONNECTOR.32
/NMI
  Top 0.14: IC3.5 38.48,28.77 38.48,34.16 38.1,34.54 31.11,34.54 31.11,27.18 31.62,26.67 31.62,23.3 31.11,22.8 31.11,14.22 U$1.B14 ZX_EXPANSION_BUS_CONNECTOR.28
/RD  (via drill 0.3)
  Top 0.14: v45.28,29.72 44.13,29.72 IC3.3 | v37.59,28.96 37.08,28.45 v37.08,25.91 | v29.27,25.91 29.27,15.81 28.26,14.8 27.2,14.8 27.2,7.98 U$1.B18 ZX_EXPANSION_BUS_CONNECTOR.36
  Bottom 0.14: v45.28,29.72 44.51,28.96 v37.59,28.96 | v29.27,25.91 v37.08,25.91
/RESET  (via drill 0.3)
  Top 0.14: ZX_EXPANSION_BUS_CONNECTOR.39 U$1.A20 21.08,2.41 21.08,2.03 20.45,1.4 16.26,1.4 16.26,15.24 14.22,17.27 v14.22,48.58 | IC3.2 44.07,30.29 38.8,30.29 38.8,36.51 36.83,38.48 31.62,38.48 30.86,39.24 v30.86,44.45
  Bottom 0.14: v30.86,44.45 24.7,50.61 15.49,50.61 14.35,51.75 RESET.2 14.29,51.75 14.22,51.75 v14.22,48.58
/RESET2
  Top 0.14: U$1.B28 ZX_EXPANSION_BUS_CONNECTOR.56
/RFSH  (via drill 0.3)
  Top 0.14: v45.28,42.29 45.28,39.56 45.72,39.12 45.72,34.34 46.45,33.6 46.45,32.88 IC3.99 | v7.56,41.97 7.18,41.97 6.6,41.4 6.6,37.59 10.03,34.16 10.03,7.62 U$1.B25 ZX_EXPANSION_BUS_CONNECTOR.50
  Bottom 0.14: v45.28,42.29 44.7,42.86 19.49,42.86 17.84,44.51 10.1,44.51 8.64,43.05 8.64,41.97 v7.56,41.97
/SRAM_OE  (via drill 0.3)
  Top 0.14: v51.12,42.29 51.12,41.97 51.94,41.15 51.94,37.34 52.01,37.27 52.01,32.83 IC3.88 | v7.87,44.83 2.6,39.56 2.6,26.92 3.62,25.91 IC4.P$24
  Bottom 0.14: v51.12,42.29 49.53,43.88 22.67,43.88 21.72,44.83 v7.87,44.83
/SRAM_WE  (via drill 0.3)
  Top 0.14: v47.82,34.99 48.51,34.29 48.51,32.77 IC3.95 | v30.35,36.32 26.73,36.32 v26.73,38.35 | v3.94,22.73 3.94,21.78 4.25,21.46 6.6,21.46 6.6,20 6.16,19.56 IC4.P$29
  Bottom 0.14: v26.73,38.35 26.48,38.1 7.18,38.1 3.94,34.86 v3.94,22.73 | v47.82,34.99 47.45,34.99 46.98,35.46 40.36,35.46 39.95,35.87 39.95,35.96 39.65,36.27 39.22,36.27 38.73,35.78 30.9,35.78 v30.35,36.32
/WAIT
  Top 0.14: U$1.B21 ZX_EXPANSION_BUS_CONNECTOR.42
/WR  (via drill 0.3)
  Top 0.14: v58.29,18.1 59.05,17.34 v59.05,9.4 | IC3.62 60.01,24.26 58.42,24.26 v58.04,23.88
  Bottom 0.14: v59.05,9.4 58.86,9.21 30.1,9.21 29.4,8.51 26.16,8.51 U$1.B19 ZX_EXPANSION_BUS_CONNECTOR.38 | v58.04,23.88 57.7,23.54 57.7,21.83 58.29,21.24 v58.29,18.1
A0  (via drill 0.3)
  Top 0.14: U$1.A9 ZX_EXPANSION_BUS_CONNECTOR.17 50.55,3.75 49.4,4.89 49.4,10.79 48.26,11.94 48.26,13.53 v48.45,13.72 | v61.28,28.96 61.02,29.21 60.07,29.21 IC3.72 | v46.42,27.43 v47.56,28.57 | v35.94,27.81 34.8,27.81 34.8,27.18 IC2.10 | IC4.P$12 19.81,29.72 19.81,29.4 v20.7,28.51 | v49.15,18.29 50.04,18.29 50.74,18.99 v50.74,28.32
  Bottom 0.14: v61.28,28.96 61.21,28.89 56.33,28.89 56.01,28.57 50.74,28.57 | v47.56,28.57 50.74,28.57 | v46.42,27.43 46.04,27.81 v35.94,27.81 21.4,27.81 v20.7,28.51 | v48.45,13.72 47.37,14.8 47.37,18.29 v49.15,18.29 | 50.74,28.57 v50.74,28.32
A1  (via drill 0.3)
  Top 0.14: ZX_EXPANSION_BUS_CONNECTOR.19 U$1.A10 | v58.74,33.02 58.74,28.77 60.01,28.77 IC3.71 | v33.59,33.4 32.58,32.38 32.58,27.88 33.05,27.4 | 33.05,27.4 34.54,25.91 IC2.9 | IC4.P$11 20,28.45 v20,27.88 | 33.05,27.4 v32.89,27.24 | v29.65,9.53 30.48,10.35 v30.48,27.24
  Bottom 0.14: v58.74,33.02 58.55,32.83 37.85,32.83 37.53,33.15 33.85,33.15 v33.59,33.4 | v20,27.88 20.64,27.24 v30.48,27.24 v32.89,27.24 | ZX_EXPANSION_BUS_CONNECTOR.19 46.74,4.95 24.89,4.95 24,5.84 24,9.53 v29.65,9.53
A2  (via drill 0.3)
  Top 0.14: ZX_EXPANSION_BUS_CONNECTOR.21 U$1.A11 43.94,2.41 43.94,1.65 43.43,1.14 41.4,1.14 41.4,9.72 37.34,13.78 v37.34,25.15 | v56.83,28.32 60.01,28.32 IC3.70 | v46.42,25.34 v47.94,26.86 | v35.94,25.27 34.8,25.27 34.8,24.64 IC2.8 | IC4.P$10 20.07,27.18 v21.14,26.1
  Bottom 0.14: v56.83,28.32 55.37,26.86 v47.94,26.86 | v46.42,25.34 46.35,25.27 37.34,25.27 | 37.34,25.27 v35.94,25.27 21.97,25.27 v21.14,26.1 | v37.34,25.15 37.34,25.27
A3  (via drill 0.3)
  Top 0.14: IC2.7 33.72,23.37 33.72,23.69 v32.83,24.57 | v19.94,25.27 18.67,25.27 IC4.P$9 | v58.86,27.3 58.86,27.75 60.01,27.75 IC3.69 | v59.82,18.1 60.2,17.72 60.2,6.86 58.04,4.7 54.1,4.7 54.1,2.03 53.47,1.4 46.74,1.4 46.74,4.45 46.1,5.08 42.67,5.08 42.13,4.54 | U$1.A12 ZX_EXPANSION_BUS_CONNECTOR.23 42.93,3.75 42.13,4.54 | v40.26,24 41.97,22.29 41.97,9.02 41.78,8.83 41.78,4.89 42.13,4.54
  Bottom 0.14: v19.94,25.27 21.4,25.27 21.72,24.96 32.45,24.96 v32.83,24.57 32.89,24.57 33.47,24 v40.26,24 | v58.86,27.3 58.86,27.24 59.82,26.29 v59.82,18.1
A4  (via drill 0.3)
  Top 0.14: U$1.A24 ZX_EXPANSION_BUS_CONNECTOR.47 12.45,3.75 13.65,4.95 v13.65,22.61 | v59.69,32.38 61.85,30.23 61.85,27.3 60.07,27.3 IC3.68 | v32.26,32.83 32.26,24.38 34.54,22.1 IC2.6 | v21.78,32.45 22.04,32.19 22.04,26.16 20.7,24.83 20.7,24.64 IC4.P$8 17.59,24.64 17.21,24.26 v17.21,23.5
  Bottom 0.14: v59.69,32.38 59.63,32.45 37.78,32.45 37.4,32.83 v32.26,32.83 32.19,32.83 32.07,32.7 22.04,32.7 v21.78,32.45 | v13.65,22.61 14.54,23.5 v17.21,23.5
A5  (via drill 0.3)
  Top 0.14: ZX_EXPANSION_BUS_CONNECTOR.45 U$1.A23 14.99,2.35 15.68,1.65 15.68,1.27 15.88,1.08 23.62,1.08 23.62,12.95 22.04,14.54 22.04,16.89 24,18.86 v24,18.92 24,20.51 23.24,21.27 23.24,23.37 IC4.P$7 | v56.2,18.86 56.2,26.73 60.01,26.73 IC3.67 | v36.77,18.86 36.77,19.81 35.75,20.83 IC2.5
  Bottom 0.14: v56.2,18.86 v36.77,18.86 24.07,18.86 v24,18.92
A6  (via drill 0.3)
  Top 0.14: IC4.P$6 20.51,22.1 20.51,19.62 | 20.51,19.62 20.51,10.6 18.69,8.79 18.69,4.85 ZX_EXPANSION_BUS_CONNECTOR.43 U$1.A22 | v56.77,25.97 56.77,26.23 60.01,26.23 IC3.66 | v50.16,20.83 46.86,20.83 v46.86,20.51 | v33.4,19.62 34.73,19.62 34.73,19.56 IC2.4 | v20.89,19.62 20.51,19.62
  Bottom 0.14: v56.77,25.97 51.63,20.83 v50.16,20.83 | v46.86,20.51 45.97,19.62 v33.4,19.62 v20.89,19.62
A7  (via drill 0.3)
  Top 0.14: IC4.P$5 17.14,20.83 17.14,22.42 17.46,22.73 21.46,22.73 21.46,20.77 | 21.46,20.77 21.46,5.08 ZX_EXPANSION_BUS_CONNECTOR.41 U$1.A21 | v57.98,31.56 57.98,32.64 58.04,32.7 IC3.76 | v37.34,32.13 36.51,31.3 36.51,22.35 35.56,21.4 32.83,21.4 32.83,20.77 | 32.83,20.77 32.83,19.43 33.97,18.29 IC2.3 | v22.73,20.77 21.46,20.77 | v32.77,20.77 32.83,20.77
  Bottom 0.14: v57.98,31.56 57.4,32.13 v37.34,32.13 | v32.77,20.77 v22.73,20.77
A8  (via drill 0.3)
  Top 0.14: IC4.P$27 6.99,22.1 6.99,22.04 | ZX_EXPANSION_BUS_CONNECTOR.52 U$1.B26 6.91,7.95 6.91,22.04 6.99,22.04 | v50.55,31.56 50.55,32.7 IC3.91 | v31.69,31.56 31.94,31.3 v31.94,22.86 | v26.54,21.72 26.29,21.46 26.29,19.81 26.04,19.56 IC2.25 | v8.95,22.04 6.99,22.04
  Bottom 0.14: v31.69,31.56 v50.55,31.56 | v31.94,22.86 30.8,21.72 v26.54,21.72 26.48,21.72 26.16,22.04 v8.95,22.04
A9  (via drill 0.3)
  Top 0.14: IC4.P$26 9.53,23.37 9.53,21.46 | 9.53,21.46 9.53,9.14 8.64,8.26 8.64,5.71 8,5.08 4.83,5.08 ZX_EXPANSION_BUS_CONNECTOR.53 U$1.A27 | v50.99,33.97 50.99,32.83 51.05,32.77 IC3.90 | v37.91,33.97 38.16,33.72 v38.16,22.86 | v24,21.46 25.15,21.46 25.15,20.83 IC2.24 | v9.46,21.46 9.53,21.46
  Bottom 0.14: v50.99,33.97 50.48,33.47 38.42,33.47 v37.91,33.97 | v38.16,22.86 32.83,22.86 31.3,21.34 26.92,21.34 26.73,21.14 24.32,21.14 v24,21.46 v9.46,21.46
A10  (via drill 0.3)
  Top 0.14: ZX_EXPANSION_BUS_CONNECTOR.54 U$1.B27 v4.83,14.16 | v52.51,37.53 52.51,32.77 IC3.87 | v7.3,36.13 7.3,28.07 6.41,27.18 IC4.P$23 | IC2.21 22.92,24.64 v22.92,26.42
  Bottom 0.14: v52.51,37.53 52.26,37.78 8.95,37.78 v7.3,36.13 5.84,36.13 5.84,29.02 7.94,26.92 8.83,26.92 | v22.92,26.42 22.42,26.92 8.83,26.92 | v4.83,14.16 4.83,19.11 2.48,19.11 2.1,19.49 2.1,22.16 4.13,22.16 8.83,26.86 8.83,26.92
A11  (via drill 0.3)
  Top 0.14: U$1.A28 ZX_EXPANSION_BUS_CONNECTOR.55 2.29,3.75 0.95,5.08 0.95,17.97 v2.67,19.68 | v50.35,42.29 51.63,41.02 51.63,32.77 IC3.89 | 22.35,24.7 v22.35,43.43 | 22.35,24.7 24.96,22.1 IC2.23 | v9.46,24.64 IC4.P$25 | v21.27,24.64 22.29,24.64 22.29,24.7 22.35,24.7
  Bottom 0.14: v50.35,42.29 49.21,43.43 v22.35,43.43 | v21.27,24.64 v9.46,24.64 7.62,24.64 v2.67,19.68
A12  (via drill 0.3)
  Top 0.14: v32.19,20.19 32.45,19.94 32.45,17.02 IC2.2 37.02,17.02 37.02,10.99 39.31,8.7 39.31,2.35 v39.18,2.22 | v19.94,20.19 18.67,20.19 IC4.P$4 | v56.83,27.56 56.26,28.13 56.26,28.51 56.45,28.7 56.45,30.8 57.47,31.81 57.47,32.64 57.53,32.7 IC3.77 | v67.88,21.27 67.63,21.02 67.63,20.45 67.12,19.94 67.12,15.68 68.14,14.67 68.14,8.7 67.31,7.87 67.31,4.7 ZX_EXPANSION_BUS_CONNECTOR.3 U$1.A2
  Bottom 0.14: v19.94,20.19 v32.19,20.19 | v56.83,27.56 57.15,27.88 59.05,27.88 63.06,23.88 63.06,21.27 v67.88,21.27 | v39.18,2.22 40.01,1.4 59.56,1.4 62.87,4.7 67.31,4.7 ZX_EXPANSION_BUS_CONNECTOR.3
A13  (via drill 0.3)
  Top 0.14: IC3.26 46.06,16.76 46.06,11.53 48.83,8.76 v48.83,8.64
  Bottom 0.14: v48.83,8.64 48.96,8.76 67.06,8.76 U$1.B2 ZX_EXPANSION_BUS_CONNECTOR.4
A14  (via drill 0.3)
  Top 0.14: v45.66,11.05 45.66,17.78 46.29,17.78 46.48,17.59 46.48,16.89 46.55,16.83 IC3.27
  Bottom 0.14: v45.66,11.05 46.16,10.54 69.22,10.54 71.88,7.87 71.88,3.68 ZX_EXPANSION_BUS_CONNECTOR.1 U$1.A1
A15  (via drill 0.3)
  Top 0.14: v48.7,9.97 48.45,9.97 46.61,11.81 46.61,14.22 47.04,14.66 47.04,16.75 47.05,16.76 IC3.28
  Bottom 0.14: v48.7,9.97 68.39,9.97 U$1.B1 ZX_EXPANSION_BUS_CONNECTOR.2
BANK0  (via drill 0.3)
  Top 0.14: v45.66,21.53 50.23,26.1 50.23,26.48 49.97,26.73 49.97,32.64 50.04,32.7 IC3.92 | v3.94,20.19 5.21,20.19 IC4.P$28 | v38.61,20.32 37.91,19.62 v37.91,18.29
  Bottom 0.14: v45.66,21.53 45.47,21.34 41.02,21.34 40.01,20.32 v38.61,20.32 | v37.91,18.29 16.51,18.29 14.61,20.19 v3.94,20.19
BANK1  (via drill 0.3)
  Top 0.14: v55.37,33.97 55.5,33.85 55.5,32.83 IC3.81 | v16.89,35.37 16.32,34.8 16.32,18.48 17.04,17.75 17.04,16.73 17.41,16.36 20.07,16.36 20.07,17.72 19.49,18.29 IC4.P$3
  Bottom 0.14: v55.37,33.97 51.82,33.97 51.24,34.54 50.1,34.54 49.34,33.78 38.86,33.78 38.1,34.54 33.27,34.54 33.02,34.29 21.97,34.29 20.89,35.37 v16.89,35.37
BANK2
  Top 0.14: IC4.P$31 6.03,17.02 6.48,17.46 6.48,18.8 4.38,18.8 2.29,20.89 2.29,39.69 4.83,42.23 4.83,53.98 7.11,56.26 45.34,56.26 48.2,53.4 48.2,38.73 47.24,37.78 47.24,34.8 48.01,34.04 48.01,32.83 IC3.96
BANK3  (via drill 0.3)
  Top 0.14: v55.88,40.77 56.01,40.64 56.01,39.12 57.78,37.34 57.78,35.43 57.15,34.8 57.15,32.83 57.09,32.77 IC3.78 | v28.26,41.72 22.92,41.72 22.92,43.62 22.54,44.01 18.8,44.01 18.8,36.51 16.64,34.35 16.64,18.73 18.35,17.02 IC4.P$2
  Bottom 0.14: v55.88,40.77 54.93,41.72 v28.26,41.72
BANK4  (via drill 0.3)
  Top 0.14: v59.63,14.41 59.63,17.53 57.15,20 57.15,22.23 60.01,22.23 IC3.58 | v19.94,15.11 18.67,15.11 IC4.P$1
  Bottom 0.14: v59.63,14.41 59.24,14.03 49.53,14.03 48.64,13.14 25.72,13.14 23.56,15.3 20.13,15.3 v19.94,15.11
BANK5
  Top 0.14: IC4.P$30 4.7,18.29 1.27,14.86 1.27,11.18 3.56,8.89 3.56,0.64 59.56,0.64 62.04,3.11 62.04,20.7 61.47,21.27 61.47,21.72 60.07,21.72 IC3.57
CLK  (via drill 0.3)
  Top 0.14: v50.16,13.46 50.16,16.7 50.1,16.76 IC3.34 | v52.07,11.56 51.82,11.3 51.82,4.95 ZX_EXPANSION_BUS_CONNECTOR.15 U$1.A8
  Bottom 0.14: v52.07,11.56 v50.16,13.46
CLK25MHZ
  Top 0.14: Q1.3 64.15,30.85 64.77,30.23 64.77,26.29 64.39,25.91 62.1,25.91 61.46,25.27 IC3.64
CS0  (via drill 0.3)
  Top 0.14: SDCARD.1 41.91,53.72 41.53,54.1 v41.53,54.99 | v61.47,14.41 61.47,19.24 60.07,19.24 IC3.52
  Bottom 0.14: v61.47,14.41 66.74,14.41 69.41,17.08 72.39,17.08 73.41,18.1 73.41,29.97 70.42,32.96 70.42,48.64 60.96,48.64 54.93,54.67 54.93,55.82 43.28,55.82 SD.C v41.53,54.99
CS1
  Top 0.14: CS1.1 35.56,41.15 41.91,34.8 41.91,33.53 44.2,31.24 45.09,31.24 45.47,30.86 45.47,30.3 45.85,29.92 45.85,29.34 45.47,28.96 45.47,27.43 45.3,27.27 IC3.8
D0  (via drill 0.3)
  Top 0.14: v33.15,28.45 IC2.11 | v21.46,28.51 18.99,30.99 IC4.P$13 | v61.28,29.72 60.07,29.72 IC3.73 | v55.88,29.21 55.44,28.77 55.44,22.29 54.99,21.84 v54.99,17.97 | v57.4,15.56 58.48,14.48 58.48,7.81 U$1.B6 ZX_EXPANSION_BUS_CONNECTOR.12 | v46.16,28.38 46.93,29.15 v49.09,29.15
  Bottom 0.14: v21.46,28.51 21.84,28.13 32.83,28.13 v33.15,28.45 33.21,28.45 33.27,28.38 v46.16,28.38 | v61.28,29.72 60.77,29.21 v55.88,29.21 55.82,29.21 55.5,28.89 49.34,28.89 v49.09,29.15 | v57.4,15.56 v54.99,17.97
D1  (via drill 0.3)
  Top 0.14: ZX_EXPANSION_BUS_CONNECTOR.14 U$1.B7 55.63,7.56 54.23,8.95 v54.23,15.56 | v59.31,33.53 59.31,32.83 59.05,32.58 59.05,30.29 60.01,30.29 IC3.74 | v34.67,33.72 33.66,32.7 33.66,31.81 33.91,31.56 35.81,31.56 35.81,30.54 34.99,29.72 IC2.12 | IC4.P$14 21.21,32.26 v21.21,33.59 | v54.23,18.29 54.23,22.35 54.67,22.8 54.67,25.34 55.12,25.78 v55.12,29.46
  Bottom 0.14: v21.21,33.59 21.59,33.97 34.35,33.97 34.61,33.72 v34.67,33.72 37.4,33.72 37.97,33.15 55.31,33.15 55.75,33.59 59.24,33.59 v59.31,33.53 59.31,33.47 60.26,33.47 60.26,31.3 58.74,29.78 55.44,29.78 v55.12,29.46 | v54.23,18.29 v54.23,15.56
D2  (via drill 0.3)
  Top 0.14: ZX_EXPANSION_BUS_CONNECTOR.16 U$1.B8 v53.09,15.56 | v59.63,31.43 59.63,31.18 60.01,30.8 IC3.75 | IC2.13 v33.4,30.99 | IC4.P$15 17.21,33.53 v17.21,31.3 | v53.47,30.92 v53.47,17.97
  Bottom 0.14: v59.63,31.43 59.18,30.99 53.47,30.99 | 53.47,30.99 47.82,30.99 47.56,31.24 33.66,31.24 v33.4,30.99 28.7,30.99 17.53,30.99 v17.21,31.3 | v53.09,15.56 53.09,17.59 v53.47,17.97 | v53.47,30.92 53.47,30.99
D3  (via drill 0.3)
  Top 0.14: ZX_EXPANSION_BUS_CONNECTOR.22 U$1.B11 45.47,7.56 43.5,9.53 v43.5,9.78 | v53.4,36.51 54.61,35.31 54.61,33.97 54.99,33.59 54.99,32.83 55.05,32.77 IC3.82 | 26.57,33.62 25.21,32.26 IC2.15 | 26.57,33.62 v28.64,35.69 | v6.73,34.8 IC4.P$17 | v29.91,10.54 30.16,10.79 30.16,26.8 29.91,27.05 29.91,30.23 26.61,33.53 26.61,33.59 26.57,33.62
  Bottom 0.14: v53.4,36.51 53.28,36.64 50.1,36.64 49.28,35.81 40.49,35.81 39.76,36.54 39.1,36.54 38.62,36.05 31.38,36.05 30.54,36.89 30.16,36.89 29.18,35.91 | 29.18,35.91 28.96,35.69 v28.64,35.69 | v6.73,34.8 7.87,35.94 29.15,35.94 29.18,35.91 | v43.5,9.78 42.74,10.54 v29.91,10.54
D4  (via drill 0.3)
  Top 0.14: v54.48,25.91 54.56,25.98 54.56,32.74 IC3.83 | v48.83,20.26 46.8,18.22 v46.8,18.03 | v42.93,14.16 U$1.B12 ZX_EXPANSION_BUS_CONNECTOR.24 | 26.48,30.99 IC2.16 | v28.7,16.26 28.7,30.99 27.43,32.26 26.8,32.26 26.48,31.94 26.48,30.99 | IC4.P$18 6.67,33.53 v6.67,33.08 | 26.48,30.99 v26.48,30.42
  Bottom 0.14: v48.83,20.26 v54.48,25.91 | v46.8,18.03 v42.93,14.16 42.16,14.92 30.04,14.92 v28.7,16.26 | v6.67,33.08 6.16,32.58 6.16,30.42 v26.48,30.42
D5  (via drill 0.3)
  Top 0.14: ZX_EXPANSION_BUS_CONNECTOR.20 U$1.B10 48.01,7.56 43.5,12.06 43.5,17.46 42.86,18.1 v42.86,21.91 | v54.04,35.12 54.04,32.77 IC3.84 | v26.29,34.86 24.13,32.7 24.13,31.88 | 24.13,31.88 24.13,30.16 24.57,29.72 IC2.17 25.21,29.65 26.1,29.65 26.29,29.46 26.29,24.64 v26.54,24.38 | v6.73,32.26 IC4.P$19 | 24.13,31.88 v23.88,31.88
  Bottom 0.14: v54.04,35.12 50.23,35.12 49.21,34.1 38.99,34.1 38.23,34.86 33.15,34.86 32.89,34.61 26.54,34.61 v26.29,34.86 | v6.73,32.26 7.11,31.88 v23.88,31.88 | v42.86,21.91 41.34,23.43 27.5,23.43 v26.54,24.38
D6  (via drill 0.3)
  Top 0.14: IC2.18 23.69,28.45 v23.69,28.7 23.69,28.77 23.3,29.15 23.3,32.64 v25.53,34.86 | v6.67,29.84 6.67,30.61 6.29,30.99 IC4.P$20 | v52.7,17.97 52.7,31.18 53.57,32.04 IC3.85 53.59,32.83 53.66,32.89 53.66,34.73 53.47,34.92 53.47,35.62 v53.4,35.69 | v52.32,15.56 50.74,13.97 50.74,7.68 U$1.B9 ZX_EXPANSION_BUS_CONNECTOR.18
  Bottom 0.14: v23.69,28.7 22.54,29.84 v6.67,29.84 | v52.7,17.97 52.7,15.94 v52.32,15.56 | v25.53,34.86 26.1,35.43 28.13,35.43 28.64,34.92 32.77,34.92 33.02,35.18 46.86,35.18 47.62,34.42 49.09,34.42 50.16,35.5 53.21,35.5 v53.4,35.69
D7  (via drill 0.3)
  Top 0.14: IC2.19 22.92,27.18 v22.92,28.7 22.92,28.77 22.99,28.83 22.99,35.37 v28.26,40.64 | v6.54,29.08 5.21,29.08 IC4.P$21 | v63.88,21.84 64.14,21.59 64.14,16.51 65.79,14.86 U$1.B3 ZX_EXPANSION_BUS_CONNECTOR.6 | IC3.86 53.09,32.77 v53.09,34.54 53.09,34.61 52.83,34.86 52.83,36.96 53.09,37.21 53.09,40.2 v52.51,40.77
  Bottom 0.14: v22.92,28.7 22.54,29.08 v6.54,29.08 | v53.09,34.54 61.09,34.54 63.37,32.26 63.37,21.84 v63.88,21.84 | v28.26,40.64 28.38,40.77 v52.51,40.77
E  (via drill 0.3)
  Top 0.14: v64.83,49.21 65.91,48.13 JUMPER_E.5 65.91,48.07 64.64,46.8 64.64,44.96 73.22,36.39 73.22,21.78 v72.52,21.08 | v56.64,17.97 56.64,16.89 56.58,16.83 IC3.47
  Top 0.152: JUMPER_E.5 JUMPER_E.2
  Bottom 0.14: v64.83,49.21 61.98,49.21 56.2,54.99 E.C | v56.64,17.97 57.09,17.53 65.02,17.53 67.88,20.38 71.82,20.38 v72.52,21.08
GND  (via drill 0.3, 0.35)
  Top 0.203: IC3.65 61.2,25.77 62.23,26.8 62.94,26.8 C4.2 63.01,26.8 v64.14,26.8 | IC3.60 61.57,23.27 62.11,22.73 C3.2 63.01,22.73 v64.14,22.73 | IC3.46 56.05,14.18 56.79,13.44 56.79,12.73 C11.2 v57.91,12.7 | IC3.10 42.4,26.27 42.04,25.91 | IC3.11 42.17,25.77 42.04,25.91 | IC3.93 49.53,32.79 49.53,34.92 49.91,35.31 49.91,36.05 C6.1 v50.93,36.07 | IC3.79 56.55,34.7 56.55,34.83 57.15,35.43 57.15,35.98 C8.2 57.01,37.2 v57.02,37.21 | IC3.32 49.07,12.77 C12.2 v50.16,12.7 | C9.2 39.38,25.91 | 39.38,25.91 C7.2 | 42.04,25.91 v40.26,25.91 39.38,25.91 | SDCARD.3 46.99,39.94 C13.2 v45.97,39.62 | R4.2 v67.56,14.48 | JUMPER_E.4 v69.09,50.66 JUMPER_E.3 | IC1.1 66.78,20.93 | 66.04,19.12 C2.2 | SDCARD.6 54.61,41.27 v54.48,41.15 | RESET.3 9.71,51.69 9.02,51.69 8.38,51.05 8.38,49.48 RESET.4 RESET.1 20.63,49.3 NMI.4 23.77,52.43 | NMI.3 24.42,53.09 23.77,52.43 | NMI.1 24.36,51.84 23.77,52.43 | IC4.P$22 v3.17,28.45 | IC2.20 v23.5,25.91 | SDCARD.M2 v33.78,58.42 | SDCARD.M3 v64.01,58.42 | SDCARD.M1 v35.43,44.45 | SDCARD.M4 63.37,44.45 v64.01,43.81 | IC4.P$16 v20.7,34.8 | IC2.14 v36.58,32.26 | Q1.2 v62.24,32.65 v62.23,32.64 | v33.4,14.1 31.62,15.88 31.62,20.95 32.77,22.1 v33.15,22.1
  Top 0.406: C1.2 70.42,17.85 v70.23,17.65 | C2.2 66.11,17.85 v65.91,17.65 | C10.1 v29.21,13.97 | C5.2 v8.89,13.97 | 66.78,20.93 66.04,20.19 66.04,19.12
  Bottom 0.203: JTAG.2 17.78,39.75 17.14,39.12 9.14,39.12 JTAG.10 6.48,40.64 5.97,41.15 5.97,48.64 6.62,49.3 RESET.4 | v27.81,37.21 27.43,36.83 v25.65,36.83 | v58.17,25.53 58.8,25.53 58.93,25.4 58.93,23.62 v58.67,23.37
  other vias: 67.44,11.43 70.23,16 65.41,21.97 20.57,40.64 26.92,26.29 27.18,31.62 29.97,31.62 21.69,35.36 24,35.05 61.98,37.21 41.15,36.96 48.9,37.21 34.92,37.08 40.39,21.97 40.26,14.1
  pour Bottom: 0,0 73.91,0 73.91,59.94 0,59.94
  pour Top (rank 2): 0,0 73.91,0 73.91,59.94 0,59.94
IORQGE
  Top 0.14: ZX_EXPANSION_BUS_CONNECTOR.25 U$1.A13
MISO  (via drill 0.3)
  Top 0.14: v60.71,18.1 60.07,18.73 IC3.51 | v64.71,24.32 v64.71,20.13 | v64.96,25.72 65.09,25.84 65.09,32.26 56.9,40.45 56.86,40.45
  Top 0.152: SDCARD.7 57.15,41.02 56.86,40.73 56.86,40.45 R6.2
  Bottom 0.14: v60.71,18.1 62.74,20.13 v64.71,20.13 | v64.71,24.32 64.71,25.72 v64.96,25.72
MOSI  (via drill 0.3)
  Top 0.14: SDCARD.2 44.58,42.29 44.58,31.62 45.34,31.62 45.97,30.99 45.97,30.23 46.48,29.72 49.66,29.72 v49.66,26.29 | v57.72,21.08 57.72,20.83 58.76,19.79 60.04,19.79 IC3.53
  Bottom 0.14: v49.66,26.29 49.91,26.54 56.96,26.54 57.4,26.1 57.4,25 57.42,24.98 57.42,21.38 v57.72,21.08
N$1  (via drill 0.3)
  Top 0.14: v38.04,54.17 29.59,45.72 R5.1
  Bottom 0.14: v38.04,54.17 38.92,55.05 39.37,55.05 39.43,55.05 40.29,55.05 SD.A
N$2  (via drill 0.3)
  Top 0.14: v39.24,53.59 29.34,43.69 R1.2
  Bottom 0.14: v39.24,53.59 39.5,53.85 52.9,53.85 54.04,54.99 E.A
N$18
  Top 0.152: SDCARD.8 58.67,41.66 60.11,40.22 R7.1
N$20
  Top 0.152: SDCARD.9 39.37,39.79 R8.1
ROM1OE  (via drill 0.3)
  Top 0.14: v45.15,38.92 45.15,33.66 46.04,32.77 IC3.100 | v63.82,15.75 63.25,15.18 U$1.B4 ZX_EXPANSION_BUS_CONNECTOR.8
  Bottom 0.14: v45.15,38.92 45.15,40.2 63.69,40.2 64.14,40.64 64.14,42.29 64.64,42.8 69.85,42.8 70.1,42.55 70.1,21.65 72.71,21.65 73.09,21.27 73.09,18.22 67.25,18.22 64.77,15.75 v63.82,15.75
ROM2OE  (via drill 0.3)
  Top 0.14: v39.05,29.53 39.05,29.27 IC3.4 | v29.34,29.02 29.59,28.77 29.59,26.35 29.84,26.1 29.84,11.24 28.96,10.35 28.96,5.84 29.72,5.08 35.31,5.08 ZX_EXPANSION_BUS_CONNECTOR.29 U$1.A15
  Bottom 0.14: v39.05,29.53 35.62,29.53 35.12,29.02 v29.34,29.02
ROMCS  (via drill 0.3)
  Top 0.14: v40.32,11.56 38.48,13.4 38.48,18.8 39.18,19.49 39.18,23.43 38.61,24 38.61,28.26 44.07,28.26 IC3.6
  Bottom 0.14: v40.32,11.56 39.88,11.11 14.67,11.11 10.92,7.37 10.92,3.68 ZX_EXPANSION_BUS_CONNECTOR.49 U$1.A25
SCK  (via drill 0.3)
  Top 0.14: SDCARD.5 54.17,40.32 v54.17,37.53 | v61.28,20.7 60.9,20.32 60.07,20.32 IC3.54
  Bottom 0.14: v54.17,37.53 54.42,37.78 67.31,37.78 68.45,36.64 68.45,20.7 v61.28,20.7
TCK  (via drill 0.3)
  Top 0.14: v45.09,12.57 45.09,19.24 44.13,19.24 IC3.24 | v12.76,12 13.02,12.26 13.02,21.78 11.68,23.11 v11.68,41.4
  Bottom 0.14: v45.09,12.57 44.64,12.13 12.89,12.13 v12.76,12 | v11.68,41.4 11.68,44.2 16.76,44.2 JTAG.1
TDI  (via drill 0.3)
  Top 0.14: v45.78,20.19 45.78,19.81 44.13,19.81 IC3.23 | v40.64,20.19 39.05,18.61 v39.05,16.57 | v12.45,16.83 10.35,18.92 10.35,38.16 8.89,39.62 8.89,41.91 JTAG.9
  Bottom 0.14: v45.78,20.19 45.53,19.94 40.89,19.94 v40.64,20.19 | v39.05,16.57 38.8,16.83 v12.45,16.83
TDO  (via drill 0.3)
  Top 0.14: v43.62,18.1 43.62,18.29 44.07,18.73 IC3.25 | v16.26,17.78 16,18.03 16,39.5 16.26,39.75 16.26,42.16 JTAG.3
  Bottom 0.14: v43.62,18.1 42.99,17.46 16.57,17.46 v16.26,17.78
TMS  (via drill 0.3)
  Top 0.14: v45.28,20.77 45.21,20.7 45.21,20.32 44.13,20.32 IC3.22 | v41.4,20.51 41.21,20.32 v41.21,16.89 | v11.18,18.86 11.18,41.08 11.11,41.15 11.11,42.1 12.19,43.18 JTAG.5
  Bottom 0.14: v45.28,20.77 45.02,20.51 v41.4,20.51 | v41.21,16.89 40.96,17.14 12.89,17.14 v11.18,18.86
U
  Top 0.14: ZX_EXPANSION_BUS_CONNECTOR.35 U$1.A18
V
  Top 0.14: ZX_EXPANSION_BUS_CONNECTOR.33 U$1.A17
Y
  Top 0.14: ZX_EXPANSION_BUS_CONNECTOR.31 U$1.A16

### Text on the board
tPlace: JLCJLCJLCJLC
tDocu: ZX BUS EXPANSOR GOES HERE!
bDocu: K A | K A | SD / ACTIVITY | FIRMWARE / UPDATE | DIS. / / / EN. | ZX BUS CONNECTOR GOES HERE!